# Altium schematic sheet Green_Light_Check.SchDoc: TSAL_Inverter Enclosure
size 420 x 297 mm; Date: 23/04/24; DrawnBy: Georgios Papandreou; Revision: 4; SheetNumber: 1; SheetTotal: 4; CarNum: E5; CurrentSheet: 1; TotalSheet: 3
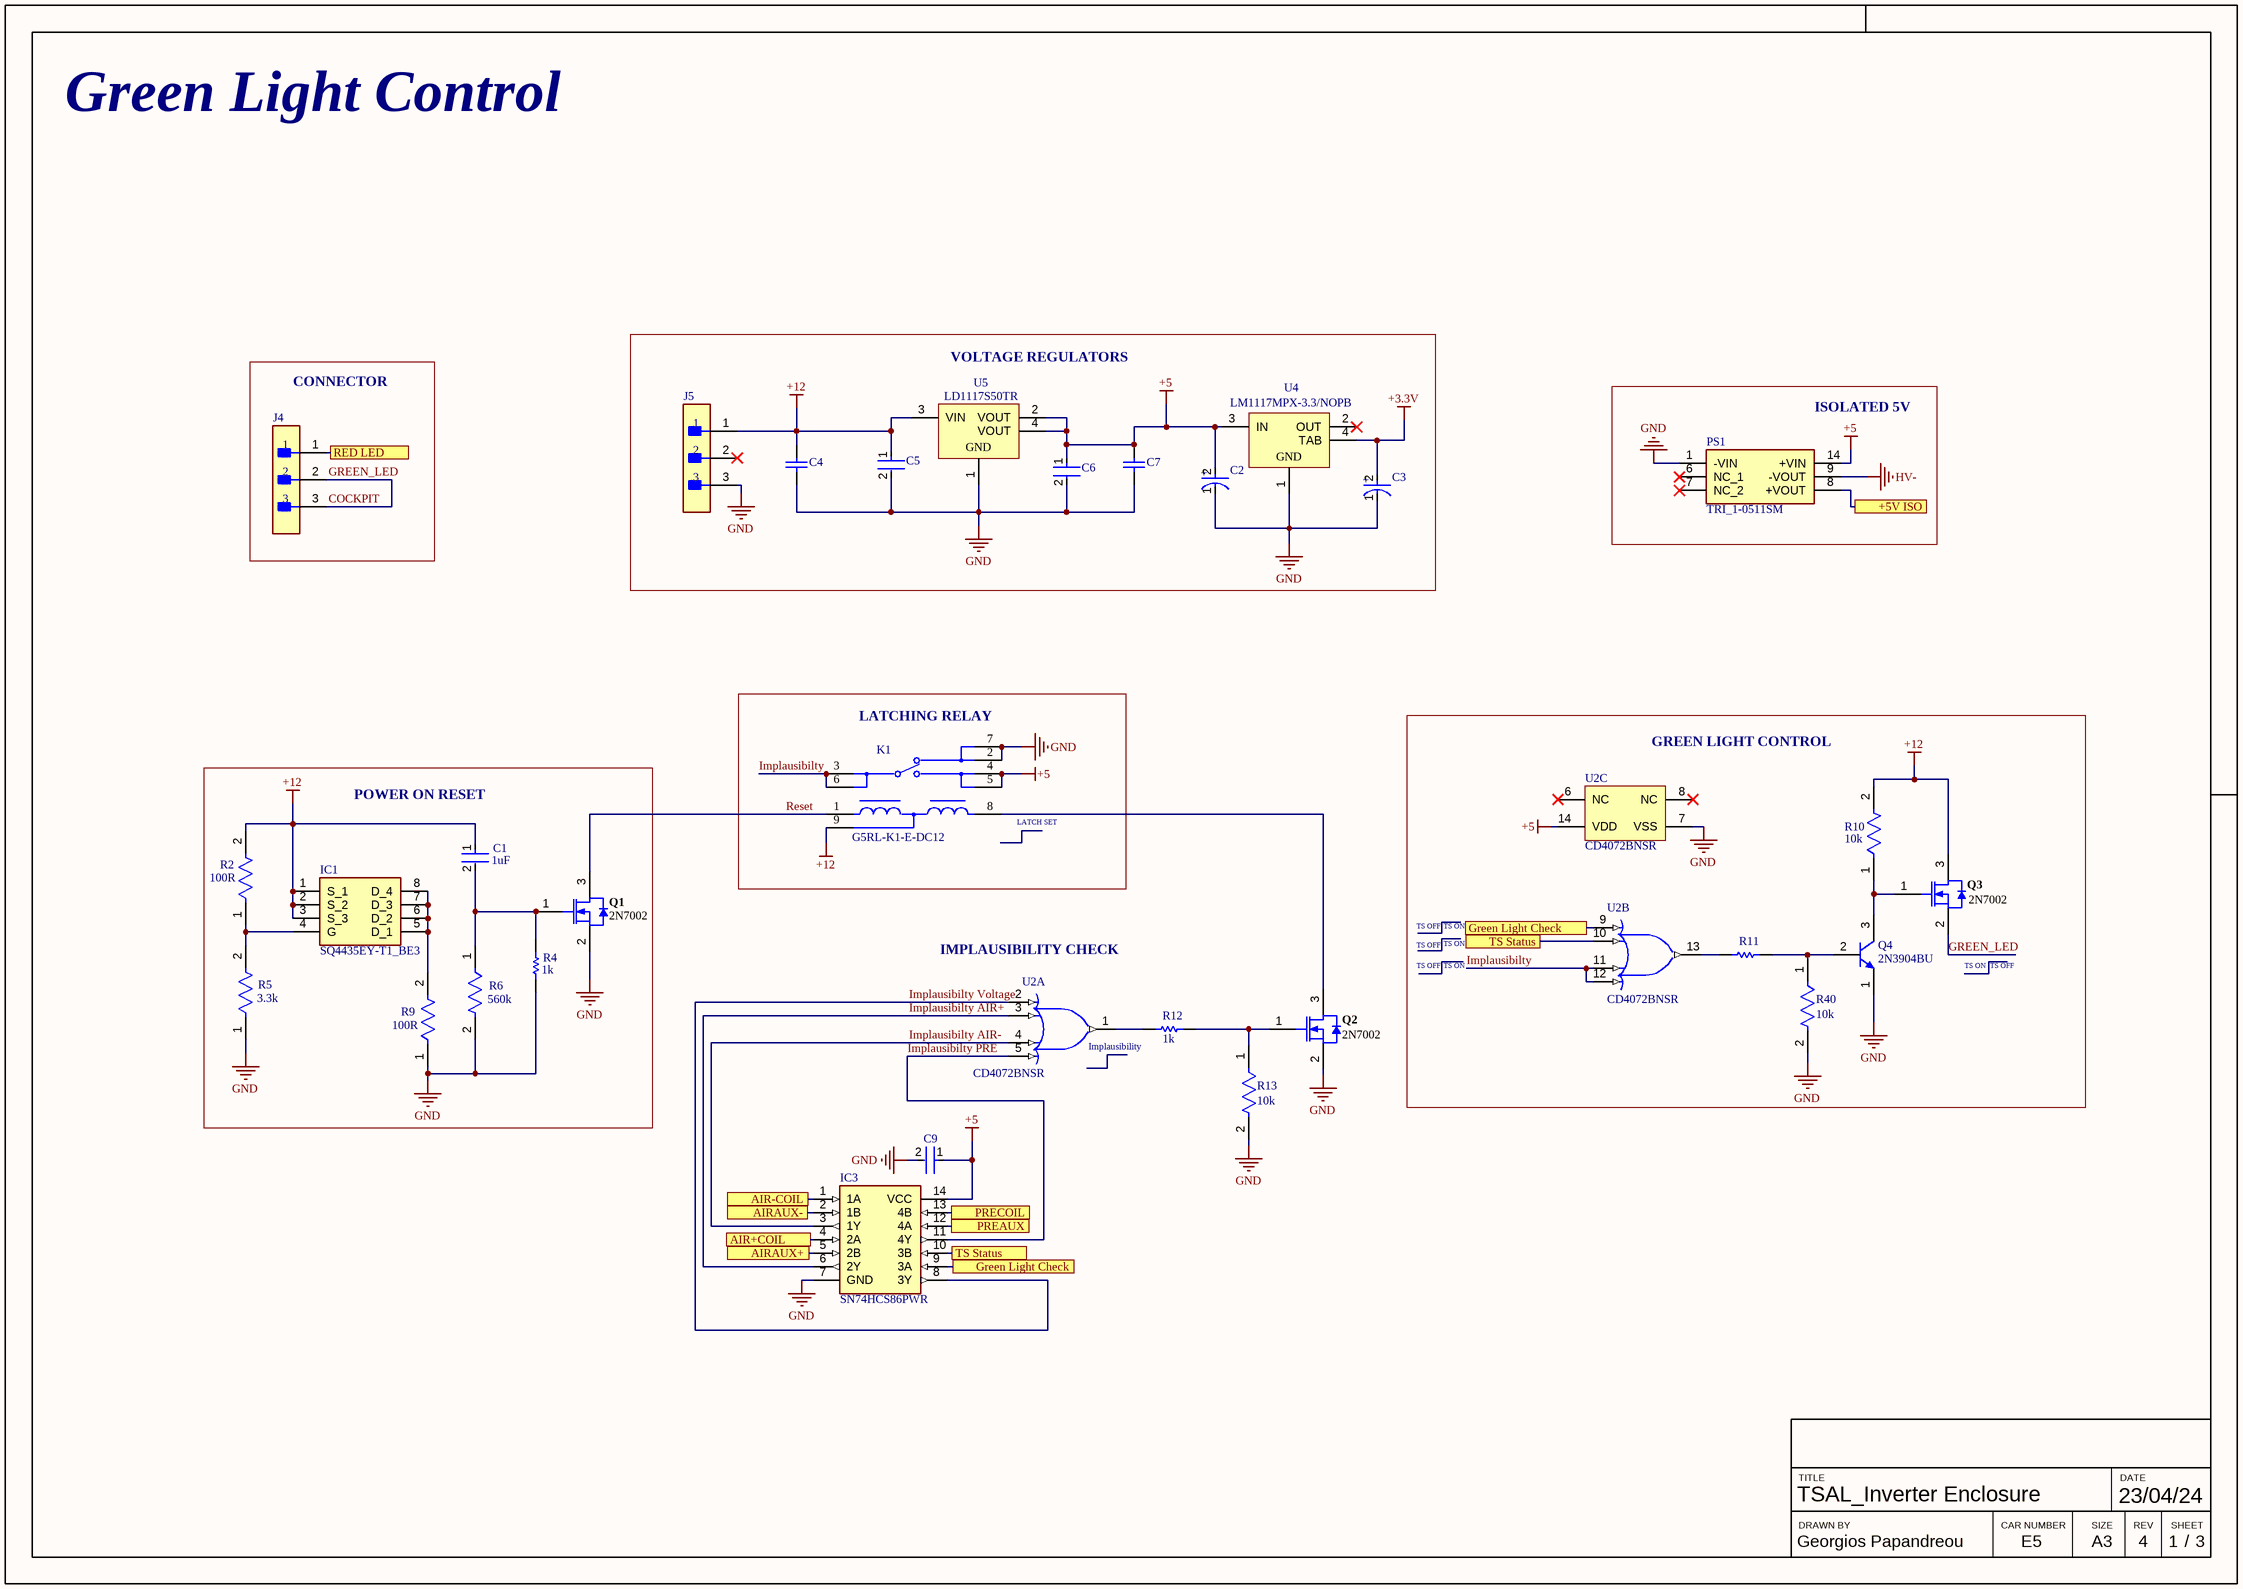
[diagram p0: Green_Light_Check.SchDoc]

## Parts
C1  CGA5L2X7R1E105K160AA  [FP-CGA5L-0_3-0_1-MFG]  (value not drawn)
C2  TAJP106M010RNJ  [FP-TAJP-MFG]  (value not drawn)
C3  TAJP106M010RNJ  [FP-TAJP-MFG]  (value not drawn)
C4  C1206C106K8RACTU  [CAPC3216X180X50LL20T25]  (value not drawn)
C5  CL21B104KBCNNNC  [FP-CL21-IPC_C]  (value not drawn)
C6  CL21B104KBCNNNC  [FP-CL21-IPC_C]  (value not drawn)
C7  C1206C106K8RACTU  [CAPC3216X180X50LL20T25]  (value not drawn)
C9  CL21B104KBCNNNC  [FP-CL21-IPC_C]  (value not drawn)
IC1  SQ4435EY-T1_BE3  [SOIC127P600X175-8N]
IC3  SN74HCS86PWR  [SOP65P640X120-14N]
J4  22-04-1031  [FP-22-04-1031-MFG]  (value not drawn)
J5  22-04-1031  [FP-22-04-1031-MFG]  (value not drawn)
K1  G5RL-K1-E-DC12  [FP-G5RL-K1-E-DC12-MFG]
PS1  TRI_1-0511SM  [TRI10511SM]
Q1  2N7002  [INF-PG-SOT23_M]
Q2  2N7002  [INF-PG-SOT23_M]
Q3  2N7002  [INF-PG-SOT23_M]
Q4  2N3904BU  [FAIR-TO-92]
R2  CRCW1206100RFKEA  [FP-CRCW1206-e3-MFG]  (value not drawn)
R4  1K 1% 1206(3216)  [RESC1206(3216)_N]  (value not drawn)
R5  CRCW12063K30FKEB  [FP-CRCW1206-e3-IPC_B]  (value not drawn)
R6  RT1206BRD07560KL  [FP-RT1206-MFG]  (value not drawn)
R9  CRCW1206100RFKEA  [FP-CRCW1206-e3-MFG]  (value not drawn)
R10  CRCW120610K0FKEA  [FP-CRCW1206-e3-IPC_C]  (value not drawn)
R11  RK73B2ATTD102J  [RESC2013X60X30ML20T20]  (value not drawn)
R12  RK73B2ATTD102J  [RESC2013X60X30ML20T20]  (value not drawn)
R13  CRCW120610K0FKEA  [FP-CRCW1206-e3-IPC_C]  (value not drawn)
R40  CRCW120610K0FKEA  [FP-CRCW1206-e3-IPC_C]  (value not drawn)
U2  CD4072BNSR  [NS0014A_M]  (parts A,B,C of 3)
U4  LM1117MPX-3.3/NOPB  [DCY0004A_L]
U5  LD1117S50TR  [SOT-223_L]

## Blocks framed on the sheet
CONNECTOR: J4
VOLTAGE REGULATORS: C2-C7 J5 U4 U5
ISOLATED 5V: PS1
LATCHING RELAY: K1
GREEN LIGHT CONTROL: Q3 Q4 R10 R11 R40 U2
POWER ON RESET: C1 IC1 Q1 R2 R4-R6 R9

## Ports
+5V ISO (see Red_Light_Check[3C], Red_Light_Check[4B], TSAC_Logic[4B], TSAC_Logic[5A]), AIR+COIL (see TSAC_Logic[4B]), AIR-COIL (see TSAC_Logic[4B]), AIRAUX+ (see TSAC_Logic[4B]), AIRAUX- (see TSAC_Logic[4B]), Green Light Check (see Green_Light_Check[3D], TSAC_Logic[4B]), Green Light Check (see Green_Light_Check[4C], TSAC_Logic[4B]), PREAUX (see TSAC_Logic[5B]), PRECOIL (see TSAC_Logic[5B]), RED LED (see Red_Light_Check[3C]), TS Status (see Green_Light_Check[3D], TSAC_Logic[6C]), TS Status (see Green_Light_Check[4C], TSAC_Logic[6C])

## Nets
+3.3V: C3.2(A) U4.4(TAB)
+5: C2.2(A) C6.1 C7.2 C9.1 IC3.14(VCC) K1.4 K1.5 PS1.14(+VIN) U2.14(VDD) U4.3(IN) U5.2(VOUT) U5.4(VOUT)
+12: C1.1 C4.2 C5.1 IC1.1(S_1) IC1.2(S_2) IC1.3(S_3) J5.1 K1.9(S+/R+) Q3.3(DRAIN) R2.2 R10.2 U5.3(VIN)
GND: C2.1(C) C3.1(C) C4.1 C5.2 C6.2 C7.1 C9.2 IC3.7(GND) J5.3 K1.2 K1.7 PS1.1(-VIN) Q1.2(SOURCE) Q2.2(SOURCE) Q4.1(E) R4.1 R5.1 R6.2 R9.1 R13.2 R40.2 U2.7(VSS) U4.1(GND) U5.1(GND)
HV-: PS1.9(-VOUT)
+5V ISO: PS1.8(+VOUT) ; port +5V ISO
AIR+COIL: IC3.4(2A) ; port AIR+COIL
AIR-COIL: IC3.1(1A) ; port AIR-COIL
AIRAUX+: IC3.5(2B) ; port AIRAUX+
AIRAUX-: IC3.2(1B) ; port AIRAUX-
COCKPIT: J4.2 J4.3 Q3.2(SOURCE)  [also labelled GREEN_LED]
Green Light Check: IC3.9(3A) U2.9(E) ; port Green Light Check
Implausibilty: K1.3 K1.6 U2.11(G) U2.12(H)
Implausibilty AIR+: IC3.6(2Y) U2.3(B)
Implausibilty AIR-: IC3.3(1Y) U2.4(C)
Implausibilty PRE: IC3.11(4Y) U2.5(D)
Implausibilty Voltage: IC3.8(3Y) U2.2(A)
PREAUX: IC3.12(4A) ; port PREAUX
PRECOIL: IC3.13(4B) ; port PRECOIL
RED LED: J4.1 ; port RED LED
Reset: K1.1(R-) Q1.3(DRAIN)
TS Status: IC3.10(3B) U2.10(F) ; port TS Status
NetC1_2: C1.2 Q1.1(GATE) R4.2 R6.1
NetIC1_4: IC1.4(G) R2.1 R5.2
NetIC1_5: IC1.5(D_1) IC1.6(D_2) IC1.7(D_3) IC1.8(D_4) R9.2
NetK1_8: K1.8(S-) Q2.3(DRAIN)
NetQ2_1: Q2.1(GATE) R12.2 R13.1
NetQ3_1: Q3.1(GATE) Q4.3(C) R10.1
NetQ4_2: Q4.2(B) R11.2 R40.1
NetR11_1: R11.1 U2.13(K)
NetR12_1: R12.1 U2.1(J)

Not connected (* = marked no-connect by the designer): J5 2*; PS1 6(NC_1)* 7(NC_2)*; U2 6(NC)* 8(NC)*; U4 2(OUT)*

## Notes on the sheet
- Green Light Control
- (near C1) 1uF
- (near K1) LATCH SET
- (near R10) 10k
- (near R2) 100R
- TS OFF
- TS ON
- (near R5) 3.3k
- (near R6) 560k
- (near R4) 1k
- (near U2) IMPLAUSIBILITY CHECK
- (near R9) 100R
- (near U2) Implausibility
- (near R12) 1k
- (near R40) 10k
- (near R13) 10k
- TITLE
- DATE
- DRAWN BY
- CAR NUMBER
- SIZE
- REV
- SHEET
- A3
- /
- (in symbol CMP-2007-04028-2) +

## Library data of the parts
C1 = CMP-08246-001699-1: Cap Ceramic 1uF 25V X7R 10% Pad SMD 1206 +125°C Automotive T/R; Max Operating Temperature: 125°C; Weight: 0.000571oz; Package Quantity: 2000; Width: 1.6mm; Voltage Rating: 25V; REACH SVHC: No SVHC; Height: 1.6mm; Min Operating Temperature: -55°C; Mount: Surface Mount; Case/Package: 1206; Ratings: AEC-Q200; Case Code (Imperial): 1206; Capacitance: 1uF; Termination: SMD/SMT; Length: 3.2mm; Depth: 1.6mm; Thickness: 0.075inch; Packaging: Tape and Reel; Tolerance: 10%; Dielectric: X7R; Case Code (Metric): 3216; Voltage Rating (DC): 25V; Composition: Ceramic
C2 C3 = CMP-2007-04028-2: 10uF 10V  ±20% 6Ω 0805  SMD Tantalum Capacitor; Dissipation Factor: 8%; ESR (Equivalent Series Resistance): 6R; Polarity: Polar; Leakage Current: 1uA; Height: 1.5mm; Packaging: Tape and Reel; Max Operating Temperature: 125°C; Lead Free: Lead Free; Length: 2.05mm; RoHS Compliant: Yes; Number of Pins: 2; Case Code (Metric): 2012; Series: TAJ; Height - Seated (Max): 0.059inch; Mount: Surface Mount; REACH SVHC: No SVHC; Depth: 1.35mm; Tolerance: 20%; Case Code (Imperial): 0805; Dielectric Material: Tantalum; Features: General Purpose; Voltage: 10V; Capacitance: 10uF; Package Quantity: 1; Case/Package: 0805; Voltage Rating (DC): 10V; Termination: SMD/SMT; Width: 0.053inch; Min Operating Temperature: -55°C; Voltage Rating: 10V
C4 C7 = CMP-2000-06013-1: Chip Capacitor, 10 uF, +/- 10%, 10 V, -55 to 125 degC, 1206 (3216 Metric), RoHS, Tape and Reel; Type: SMDMLCCX7R6.3-250VDCCommericalGrade; Class: Class1; Case Height: 1.6mm; Temperature Coefficient / Code: +/-15%; Capacitance: 10uF; Brand: Kemet; Case Length: 3.2mm; Dissipation Factor DF: 5; Voltage Rating: 10V; Dielectric: X7R; Tolerance: 10%; Package Reference: 1206; Dimensions: 1.6mmWx3.2mmLx1.6mmH; Series: C1206C; Minimum Operating Temperature: -55C; RoHS: Details; Termination Style: SMD/SMT; Mounting Technology: SurfaceMount; Manufacturer: Kemet; Product Category: MultilayerCeramicCapacitorsMLCC-SMD/SMT; Case Code - mm: 3216; Manufacturer URL: http://www.kemet.com/; Product: GeneralTypeMLCCs; Package Description: 2-Pin Surface Mount Device, Body 3.2 x 1.6 mm; Case Width: 1.6mm; Factory Pack Quantity: 2000; Package / Case: 1206(3216metric); Datasheet URL: http://www.kemet.com/docfinder?Partnumber=C1206C106K8RACTU; Datasheet Version: 02/2016; Operating Temperature Range: -55Cto+125C; Voltage Rating DC: 10V; Case Code - in: 1206; Maximum Operating Temperature: +125C; Packaging: Reel
C5 C6 C9 = CMP-2000-05017-2: CL21 Series 0805 100nF 50V ±10% Tolerance X7R Multilayer Ceramic Chip Capacitor; Depth: 1.25mm; Height: 0.85mm; Width: 0.049inch; Tolerance: 10%; Case Code (Metric): 2012; Case Code (Imperial): 0805; Material: Ceramic; Thickness: 0.037inch; Min Operating Temperature: -55°C; Contact Plating: Tin; Length: 2mm; Mount: Surface Mount; Voltage Rating (DC): 50V; Lead Free: Lead Free; Dielectric: X7R; Radiation Hardening: No; Capacitance: 100nF; Voltage Rating: 50V; Case/Package: 0805; Packaging: Tape and Reel; Max Operating Temperature: 125°C; Voltage: 50V
IC1 = SQ4435EY-T1_BE3: Integrated Circuit; Manufacturer_Name: Vishay; Datasheet Link: https://www.arrow.com/en/products/sq4435ey-t1-be3/vishay?region=nac; Height: 1.75mm; Manufacturer_Part_Number: SQ4435EY-T1_BE3; Mouser Part Number: 78-SQ4435EY-T1_BE3; Mouser Price/Stock: https://www.mouser.co.uk/ProductDetail/Vishay-Semiconductors/SQ4435EY-T1_BE3?qs=vmHwEFxEFR%2FvbkkgD6xsvQ%3D%3D; Arrow Part Number: SQ4435EY-T1_BE3; Arrow Price/Stock: https://www.arrow.com/en/products/sq4435ey-t1-be3/vishay?region=nac
IC3 = SN74HCS86PWR: Integrated Circuit; Manufacturer_Name: Texas Instruments; Datasheet Link: https://www.digikey.de/product-detail/de/texas-instruments/SN74HCS86PWR/296-SN74HCS86PWRCT-ND/11615756; Height: 1.2mm; Manufacturer_Part_Number: SN74HCS86PWR; Mouser Part Number: 595-SN74HCS86PWR; Mouser Price/Stock: https://www.mouser.co.uk/ProductDetail/Texas-Instruments/SN74HCS86PWR?qs=GBLSl2Akirvjol1GHn5SIA%3D%3D; Arrow Part Number: SN74HCS86PWR; Arrow Price/Stock: https://www.arrow.com/en/products/sn74hcs86pwr/texas-instruments?region=nac
J4 J5 = CMP-04776-000410-1: CONN HEADER VERT 3POS 2.5MM; Voltage Rating (AC): 250V; Number of Contacts: 3; Max Voltage Rating (DC): 250.25kV; Contact Resistance: 20mR; Hole Diameter: 1.19mm; Gender: Male; Connector Type: Male Pin; Insulation Resistance: 1GR; Glow Wire Compliant: Non-compliant; Current Rating: 3A; Contact Material: Brass; Series: KK; Number of Positions: 3; Contact Gender: Male; Mount: Through Hole; Working Voltage: 250V; Number of Poles: 3; Termination: Solder; Radiation Hardening: No; Lead Free: Lead Free; Min Operating Temperature: -40°C; Contact Mating Length: 0.295inch; Packaging: Bulk; Lead Pitch: 2.5mm; Voltage Rating: 250V; Voltage Rating (DC): 250V; Orientation: Straight; Color: Natural; Flammability Rating: UL94 V-0; Housing Material: Nylon; Pitch: 2.5mm; Contact Type: Male Pin; Number of Rows: 1; Housing Color: Natural; Max Operating Temperature: 105°C; Fastening Type: Friction; Halogen Free: Low Halogen; Contact Plating: Tin; Package Quantity: 1; Number of Circuits: 3
K1 = CMP-08822-000183-1: RELAY GEN PURPOSE SPDT 16A 12V; Relay Type: General Purpose; Coil Type: Latching, Dual Coil; Coil Resistance: 192R; Release Time: 15ms; Coil Current: 62.5mA; Coil Power: 750mW; Contact Current Rating: 16A; Termination: PC Pin; Max Operating Temperature: 85°C; Min Operating Temperature: -40°C; Mount: Through Hole; Coil Voltage (DC): 12V; Operate Time: 15ms; REACH SVHC: No SVHC; Packaging: Rail/Tube; Throw Configuration: SPDT; Package Quantity: 100; Contact Material: Silver
PS1 = TRI_1-0511SM: Power Supply; Manufacturer_Name: Traco Power; Manufacturer_Part_Number: TRI 1-0511SM; Datasheet Link: https://tracopower.com/tri1sm-datasheet/; Height: 11mm
Q1-Q3 = CMP-1149-00026-1: N-Channel OptiMOS Small-Signal-Transistor, 60 V VDS, 0.3 A ID, -55 to 150 degC, PG-SOT23, Reel, Green; Manufacturer: Infineon; RDS (on) (max) (@4.5V): 4,000 mOhm; VDS (max): 60 V; IDpuls (max): 1.2Â A; QG: 0.4Â nC; RDS (on) (max): 3,000 mOhm; RthJA (max): 250 K/W; ID (max): 0.3Â A; VGS(th) (max): 2.5Â V; VGS(th) (min): 1.5Â V; Green: TRUE; Ptot (max): 0.5Â W; PackageDescription: 3-Pin Small Outline Transistor Package, 2.9 x 1.3 mm Body, 0.95 mm Pitch; Halogen-free: TRUE; ComponentLink2Description: Datasheet; ComponentLink1URL: http://www.infineon.com/; Packing: Reel; DatasheetVersion: Rev. 2.4; PartNumber: 2N7002; PackageReference: PG-SOT23; PackageVersion: Apr-08; ComponentLink3URL: http://www.infineon.com/dgdl/SOT23-Package_Overview.pdf?folderId=db3a30431936bc4b0119532290053c66&fileId=db3a30431936bc4b0119533468123c85; ComponentLink1Description: Manufacturer URL; Mounting Technology: Surface Mount; ComponentLink3Description: Package Specification; ComponentLink2URL: http://www.infineon.com/dgdl/2N7002_Rev2.4.pdf?folderId=db3a3043156fd573011622e10b5c1f67&fileId=db3a304319bc939a0119c2a9461e79e6
Q4 = CMP-2000-04944-1: NPN General-Purpose Amplifier, 40 V VCEO, 0.2 A, -55 to 150 degC, 2-Pin TO-92, RoHS, Bulk; Manufacturer: FairchildSemiconductor; Maximum Collector Base Voltage: 60V; Minimum DC Current Gain: 40@0.1mA@1V; Maximum Collector Emitter Voltage: 40V; Maximum DC Collector Current: 0.2A; Rad Hard: No; Maximum Operating Frequency: 300(Min)MHz; Maximum Collector Emitter Saturation Voltage: 0.2@1mA@10mA; Maximum Power Dissipation: 625mW; Package Description: 3-Pin Transistor Outline Package, Body Dia 4.79 mm, Pitch 1.27 mm; Package Reference: TO-92; Pin Count: 3; Operating Temperature: -55to150degC; Category: GPBJT; Manufacturer URL: https://www.fairchildsemi.com/; Datasheet URL: https://datasheet.ciiva.com/4722/2n3904-82270-4722369.pdf; Package: 3TO-92; Packaging: Bulk; Type: NPN; Datasheet Version: Rev. 1.1.0, 10/2014; Mounting: ThroughHole
R2 R9 = CMP-2003-04801-2: RES Thick Film, 100Ω, 1%, 0.25W, 100ppm/°C, 1206; Voltage Rating (DC): 200V; Resistance: 100R; Power Rating: 250mW; Case Code (Metric): 3216; Radiation Hardening: No; Height: 0.55mm; Packaging: Tape and Reel; Depth: 1.6mm; Weight: 0.000353oz; Termination: SMD/SMT; Lead Free: Lead Free; Min Operating Temperature: -55°C; Contact Plating: Tin; Max Operating Temperature: 155°C; Case Code (Imperial): 1206; Military Standard: Not; Width: 1.6mm; Number of Pins: 2; Voltage Rating: 200V; Composition: Thick Film; Package Quantity: 5000; Tolerance: 1%; Case/Package: 1206; Mount: Surface Mount; Length: 3.2mm; Temperature Coefficient: 100ppm/°C
R4 = CMP-1014-00510-1: 1K 0.25W 1% 1206 (3216 Metric)  SMD; Case-Metric: 3216; Case-EIA: 1206; Value: 1000.00 Ohm; Power: 0.25 W; Tolerance: 1 %; Technology: SMT
R5 = CMP-02407-003770-1: RES Thick Film, 3.3kΩ, 1%, 0.25W, 100ppm/°C, 1206; Voltage Rating: 200V; Max Power Dissipation: 250mW; Resistance: 3.3kR; Temperature Coefficient: 100ppm/°C; Width: 0.063inch; Package Quantity: 10000; Min Operating Temperature: -55°C; Lead Free: Lead Free; Packaging: Tape and Reel; Termination: SMD/SMT; Max Operating Temperature: 155°C; Case Code (Imperial): 1206; Height: 0.024inch; Case/Package: 1206; Case Code (Metric): 3216; Features: Automotive AEC-Q200; Tolerance: 1%; Power Rating: 250mW; Composition: Thick Film; Weight: 0.000353oz; Length: 0.126inch; Number of Terminations: 2
R6 = CMP-2003-04198-2: RES SMD 560K OHM 0.1% 1/4W 1206; Manufacturer: Yageo; Power Rating: 0.25W; Value: 560KΩ; Voltage Rating: 200V; Temperature Coefficient: 25 ppm/°C; Tolerance: 0.005; Temperature Range Low: -55°C; Device Class L2: Resistors; ComponentLink2Description: Datasheet; Height: 0.65mm; Mouser Description: Res SMD 560K Ohm 0.1% 1/8W 1206; Temperature: -55°C to +155°C; Footprint Url: http://www.yageo.com/exep/pages/download/literatures/PYu-R_Mount_10.pdf; Resistance: 560KΩ; Device Class L3: Chip SMD Resistors; Category: Res; Manufacturer Part Number: RT1206BRD07560KL; RoHS: TRUE; Device Class L1: Passive Components; Digikey Description: RES SMD 560K OHM 0.1% 1/4W 1206; Package: RT1206; Automotive: No; ComponentLink2URL: http://www.yageo.com/documents/recent/PYu-RT_1-to-0.01_RoHS_L_9.pdf; Series: RT; Temperature Range High: +155°C; Octopart: https://octopart.com/rt1206brd07560kl-yageo-1212973; Composition: Thin Film; Lead Free: Yes; Ipc Land Pattern Name: RESC310160X55
R10 R13 R40 = CMP-2003-04807-2: RES Thick Film, 10kΩ, 1%, 0.25W, 100ppm/°C, 1206; Working Voltage: 200V; Max Power Dissipation: 250mW; Resistance: 10kR; Tolerance: 1%; Width: 0.063inch; Height: 0.55mm; Number of Pins: 2; Voltage Rating: 200V; Temperature Coefficient: 100ppm/°C; Military Standard: Not; Features: Automotive AEC-Q200; Depth: 1.6mm; Radiation Hardening: No; Termination: SMD/SMT; Case Code (Imperial): 1206; Weight: 0.000353oz; Length: 3.2mm; Package Quantity: 10; Voltage Rating (DC): 200V; Case/Package: 1206; Min Operating Temperature: -55°C; Number of Terminations: 2; Composition: Thick Film; Contact Plating: Tin; Power Rating: 250mW; Packaging: Tape and Reel; Max Operating Temperature: 155°C; Lead Free: Lead Free; Case Code (Metric): 3216
R11 R12 = CMP-2001-04656-1: Manufacturer: KOA Speer; Part Number: RK73B2ATTD102J
U2 = CMP-1573-00167-4: CMOS Dual 4-Input OR Gate, NS0014A, LARGE T&R; Manufacturer: Texas Instruments; Rating: Catalog; ICC @ Nom Voltage(Max)(mA): 0.015; VCC(Max)(V): 18; Bits(#): 2; tpd @ Nom Voltage(Max)(ns): 120; VCC(Min)(V): 3; F @ Nom Voltage(Max)(Mhz): 8; Voltage(Nom)(V): 10; Output Drive (IOL/IOH)(Max)(mA): 1.5/-1.5; DatasheetVersion: SCHS056D; Output Type: CMOS; PackageVersion: http://www.ti.com/lit/ml/msop002a/msop002a.pdf; PackageReference: NS0014A; Operating Temperature Range(C): -55 to 125; Input Type: CMOS; Generic Part Number: CD4072B
U4 = CMP-0062-01639-4: 800mA Low-Dropout Linear Regulator, 4-pin SOT-223, Pb-Free; Manufacturer: Texas Instruments; High-Reliability: Y; PowerWise: N; PackageTopMarking: XYTT*N05A; CompType: LDO IC; ComponentLink1URL: http://www.ti.com/general/docs/lit/getliterature.tsp?genericPartNumber=LM1117-N&fileType=pdf; PartNumber: LM1117MPX-3.3/NOPB; ComponentLink1Description: Datasheet URL; PinCount: 4; Code_JEDEC: TO-261-AA; PackageDescription: Molded SOT-223, 6.50 x 3.56 x 1.6mm Body, 4 Lead, 2.3mm Pitch; PackageReference: DCY0004A; RoHS: Y; Code_IPC: SOT223-4
U5 = CMP-0244-00312-1: Fixed Low Drop Positive Voltage Regulator, 5V, 4-Pin SOT-223, Tape and Reel; ComponentLink1URL: http://www.st.com; DatasheetVersion: 1/11/2011; PackageDescription: 4-Pin SOT-223 Package, 6.5 x 3.5 mm Body, 2.3 mm Pitch, 7 mm Lead Span; ComponentLink2URL: http://www.st.com/internet/com/TECHNICAL_RESOURCES/TECHNICAL_LITERATURE/DATASHEET/CD00000544.pdf; ComponentLink1Description: Manufacturer URL; PackageReference: SOT-223; PackageVersion: 2010; ComponentLink2Description: Datasheet